# Altium schematic sheet Regulator12V.SchDoc
size A4; SheetNumber: 6; SheetTotal: 8
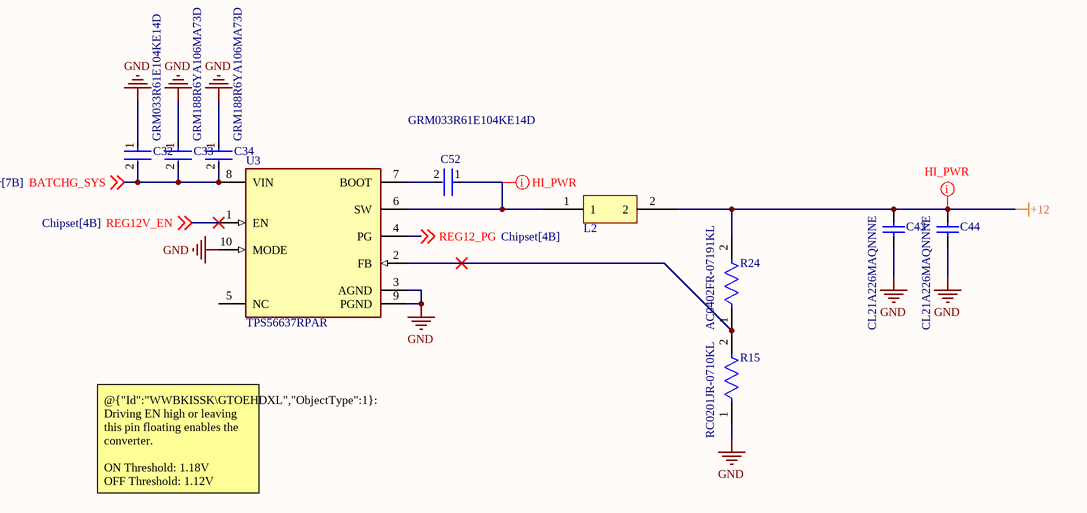
[diagram p0: Regulator12V.SchDoc]

## Parts
C32  GRM033R61E104KE14D  [FP-GRM033-0_03-IPC_B]
C33  GRM188R6YA106MA73D  [FP-GRM188-0_2-IPC_C]
C34  GRM188R6YA106MA73D  [FP-GRM188-0_2-IPC_C]
C43  CL21A226MAQNNNE  [CAPC2013X140X45LL15T25]
C44  CL21A226MAQNNNE  [CAPC2013X140X45LL15T25]
C52  GRM033R61E104KE14D  [FP-GRM033-0_03-IPC_B]
L2  IHLP3232DZER5R6M11  [IHLP3232DZER5R6M11]  (value not drawn)
R15  RC0201JR-0710KL  [FP-RC0201-0_26-IPC_C]
R24  AC0402FR-07191KL  [FP-AC0402-IPC_C]
U3  TPS56637RPAR  [FP-RPA0010A-MFG]

## Nets
+12: C43.2 C44.2 L2.2 R24.2
GND: C32.1 C33.1 C34.1 C43.1 C44.1 R15.1 U3.3(AGND) U3.9(PGND) U3.10(MODE)
BATCHG_SYS: C32.2 C33.2 C34.2 U3.8(VIN) ; off-sheet BATCHG_SYS
REG12_PG: U3.4(PG) ; off-sheet REG12_PG
REG12V_EN: U3.1(EN) ; off-sheet REG12V_EN
NetC52_1: C52.1 L2.1 U3.6(SW)
NetC52_2: C52.2 U3.7(BOOT)
NetR15_2: R15.2 R24.1 U3.2(FB)

Not connected (* = marked no-connect by the designer): U3 5(NC)

## Layout directives
net class HI_PWR: +12, NetC52_1

## Notes on the sheet
- @{"Id":"WWBKISSK\GTOEHDXL","ObjectType":1}:
  Driving EN high or leaving this pin floating enables the converter.
  ON Threshold: 1.18V
  OFF Threshold: 1.12V

## Library data of the parts
C32 C52 = CMP-06035-036234-1: Chip Multilayer Ceramic Capacitors for General Purpose, 0201, 0.10uF, X5R, 15%, 10%, 25V; Capacitance: 100nF; Case/Package: 0201; Mount: Surface Mount; Resistor Type: Ceramic; Package Quantity: 15000; Height: 0.3mm; Length: 0.024inch; Weight: 1.2E-05oz; Dielectric: X5R; Thickness: 0.013inch; Max Operating Temperature: 85°C; Case Code (Imperial): 0201; Voltage Rating: 25V; Case Code (Metric): 0603; Voltage Rating (DC): 25V; Width: 0.012inch; Termination: SMD/SMT; Tolerance: 10%; Min Operating Temperature: -55°C; Packaging: Tape and Reel; Lead Free: Lead Free
C33 C34 = CMP-06035-045466-1: Chip Multilayer Ceramic Capacitors for General Purpose, 0603, 10uF, X5R, 15%, 20%, 35V; Case Code (Imperial): 0603; Voltage Rating (DC): 35V; Width: 0.031inch; Dielectric: X5R; Voltage Rating: 35V; Min Operating Temperature: -55°C; Thickness: 0.039inch; Mount: Surface Mount; Case/Package: 0603; Length: 0.063inch; Capacitance: 10uF; Max Operating Temperature: 85°C; Packaging: Tape and Reel; Tolerance: 20%; Case Code (Metric): 1608
C43 C44 = CMP-2000-06104-1: Multi-layer Ceramic Capacitor, 22 uF, -55 to 85 degC, 2-Pin SMD (0805), RoHS, Tape and Reel; Manufacturer: Samsung Electro-Mechanics; Voltage - Rated: 25V; Other Names: 1276-2908-2; Capacitance: 22µF; Featured Product: Multi-LayerCeramicCapacitors; Product Training Modules: HighCapMLCCFamily; Temperature Coefficient: X5R; Tolerance: ±20%; Online Catalog: CLSeries,HighCapacitance; Applications: GeneralPurpose; RoHS Information: MLCCRoHS2Compliance; Height - Seated (Max): -; Lead Style: -; Lead Spacing: -; Datasheet URL: http://datasheet.octopart.com/CL21A226MAQNNNE-Samsung-datasheet-48647558.pdf; Size / Dimension: 0.079"Lx0.049"W(2.00mmx1.25mm); Thickness (Max): 0.055"(1.40mm); Family: CeramicCapacitors; Package Description: 2-Pin Surface Mount Device, Body 2.0 x 1.25 mm; Datasheet Version: 07/2015; Packaging: Tape&Reel(TR); Manufacturer URL: http://www.samsungsem.com/global/index.jsp; Ratings: -; Package / Case: 0805(2012Metric); Standard Package: 2,000; Mounting Type: SurfaceMount,MLCC; Mounting Technology: SurfaceMount; Category: Capacitors; Package Reference: 0805; Series: CL; Features: -; Operating Temperature: -55°C~85°C
R15 = CMP-03412-037826-1: RES SMD 10K OHM 5% 1/20W 0201; Voltage Rating: 25V; Max Power Dissipation: 50mW; Temperature Coefficient: 200ppm/°C; Resistance: 10kR; Min Operating Temperature: -55°C; Packaging: Tape and Reel; Tolerance: 5%; Length: 0.6mm; Contact Plating: Tin; Features: Moisture Resistant; Radiation Hardening: No; Military Standard: Not; Voltage Rating (DC): 25V; Termination: SMD/SMT; Size Code: 0201; Resistance Tolerance: 5%; Case Code (Imperial): 0201; Resistor Type: Thick Film; Depth: 0.3mm; Series: RC; Lead Free: Lead Free; Power Rating: 50mW; Number of Terminations: 2; Case Code (Metric): 0603; RoHS Compliant: Yes; Max Operating Temperature: 125°C; Construction: Rectangular; Case/Package: 0201
R24 = CMP-03412-020976-2: RES 191kΩ ±1% 0.063W 0402; Resistance: 191kR; Temperature Coefficient: 100ppm/°C; Max Power Dissipation: 63mW; Voltage Rating: 50V; Power Rating: 62.5mW; Width: 0.5mm; Number of Terminations: 2; RoHS Compliant: Yes; Case Code (Metric): 1005; Packaging: Tape and Reel; Termination: SMD/SMT; Case Code (Imperial): 0402; Min Operating Temperature: -55°C; Series: AC; Features: Moisture Resistant; Resistor Type: Thick Film; Case/Package: 0402; Max Operating Temperature: 155°C; Length: 0.039inch; Height: 0.015inch; Tolerance: 1%
U3 = CMP-04918-000008-1: IC POWER MANAGEMENT; Manufacturer: Texas Instruments; Max Duty Cycle: 91%; Nominal Supply Current: 140uA; Max Supply Voltage: 28V; Output Current: 6A; Switching Frequency: 500kHz; Output Type: AdjustableProgrammable; Max Junction Temp: +150°C; Output Voltage: 0.6-13V; Switching Topology: Buck; Standoff Height: 0mm; Number Of Outputs: 1; Min Supply Voltage: 4.5V; Automotive: No; Manufacturer Part Number: TPS56637RPAR; Lead Free: Yes; Temperature Range Low: -40°C; Digikey Description: IC POWER MANAGEMENT; Octopart: https://octopart.com/tps56637rpar-texas+instruments-97650653; Temperature: -40°C to +150°C; Device Class L3: Voltage Regulators - Switching; Temperature Range High: +150°C; Package: RPA0010A; Device Class L2: Power Management ICs; ComponentLink2URL: http://www.ti.com/lit/ds/symlink/tps56637.pdf; Device Class L1: Integrated Circuits (ICs); RoHS: TRUE; ComponentLink2Description: Datasheet; Height: 1mm; Category: IC